# EAGLE design ExtensorUSB_v1.0 (EAGLE 9.3.0)
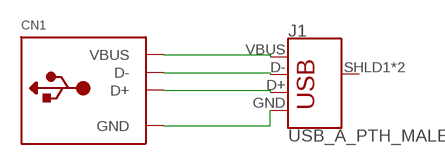
[diagram p0: schematic, sheet 1]

## Parts
CN1  USB_TYPEAPTHFML  [USB_HOST-PTH]
J1  USB_A_PTH_MALE  [USB-A-H]

## Nets
GND: CN1.GND J1.GND
N$1: CN1.VBUS J1.VBUS
N$2: CN1.D- J1.D-
N$3: CN1.D+ J1.D+
Unconnected: J1.SHLD1(SHIELD) J1.SHLD2(SHIELD)

## Library data of the parts
CN1 = microbuilder:USB_TYPEA: USB - Type A Connectors Male types stick out and are inserted into a PC or matching females parts (these are the connectors used on USB Memory Sticks, etc.). Female parts are generally used for USB Host and accept a male-type connector. SMT Male - 4UCON: 10017 PTH Female - Digikey: 609-1045-ND, 4UCon: 05241
J1 = SparkFun-Connectors:USB_A: USB-A Connector Male and female variants, as well as PTH and SMT variants SparkFun Products: SparkFun XBee Explorer Dongle <https://www.sparkfun.com/products/11697> PTH Male SparkFun MicroView-USB Programmer <https://www.sparkfun.com/products/12924> SMT Male SparkFun USB Type A Female Breakout <https://www.sparkfun.com/products/12700> SMT Female; PROD_ID: CONN-08367; SF_ID: PRT-00437

## Net classes
0 default: clearance 0.254 mm

## Board
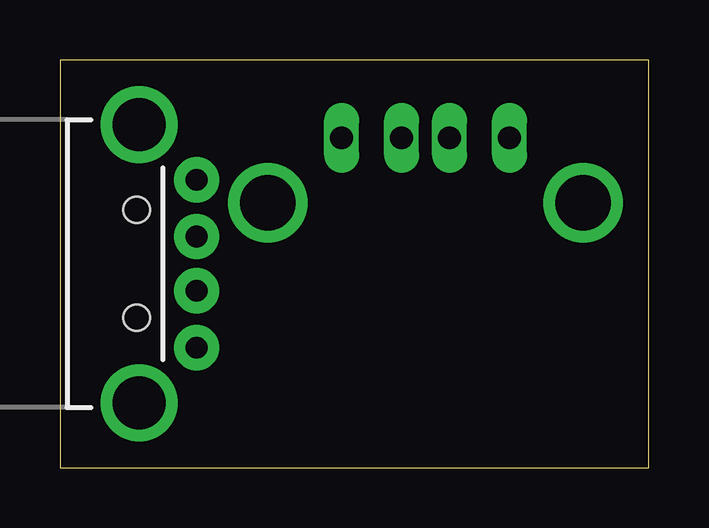
[diagram p1: board, top side]
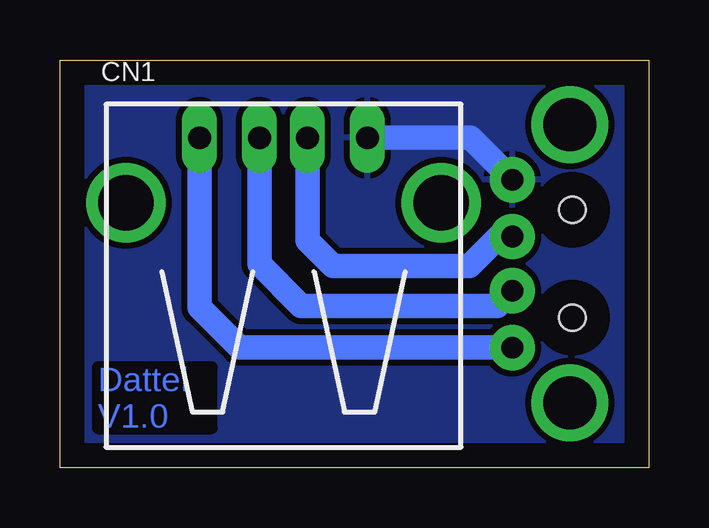
[diagram p2: board, bottom side, seen from below]

Size 24.56 x 17.01 mm. Coordinates in mm from the lower left corner, seen from the top.
Outline: 0,0 24.56,0 24.56,17.01 0,17.01 0,0
Copper layers (1*16): Top 0.035mm / dielectric 1.5mm / Bottom 0.035mm
Design rules "default": minimum track width 6mil, minimum drill 0.35mm, track to track 6mil, track to pad 6mil, pad to pad 6mil, via to via 6mil, smd to smd 6mil, copper to edge 40mil, drill to drill 6mil, minimum pad ring 10mil, minimum via ring 8mil, stop-mask expansion 4mil, vias tented up to drill 0mil, thermal gap 10mil

### Footprints (pad centres in the part's own frame; a part is rotated, then mirrored left to right if it is on the bottom)
USB_HOST-PTH = drill 0.95 long: D+ 1,6.52; D- -1,6.52; GND 3.5,6.52; VBUS -3.5,6.52 | drill 2.3 pad 2.9: S1 -6.57,3.81; S2 6.57,3.81
USB-A-H = drill 0.914 pad 1.88: D+ 2.4,1.127; D- 2.4,-1.127; GND 2.4,3.5; VBUS 2.4,-3.5 | drill 2.2: SHLD1 0,-5.8; SHLD2 0,5.8 | hole 1.1: -0.1,2.25; -0.1,-2.25

### Placement (x,y rotation side)
CN1  15.24,7.24 0 bottom
J1  3.3,8.51 0 top

### Tracks (layer width: path | path; a pad name or v marks a point on that pad's centre or on a via)
GND
  Bottom 1.016: J1.GND 7.45,13.76 CN1.GND
  pour Bottom: -0.89,-0.13 -0.89,17.14 0,18.03 24.64,18.03 25.65,17.02 25.65,-0.25 24.89,-1.02 0,-1.02
N$1
  Bottom 0.152: J1.VBUS
  Bottom 1.016: J1.VBUS 17.08,5.02 18.74,6.67 CN1.VBUS
N$2
  Bottom 1.016: J1.D- 6.33,6.76 14.5,6.76 16.24,8.49 CN1.D-
N$3
  Bottom 1.016: CN1.D+ 14.24,9.48 13.18,8.42 7.48,8.42 6.26,9.64 J1.D+

### Text on the board
Bottom: Dattel / V1.0